# EAGLE design classic2mega (EAGLE 8.7.1)
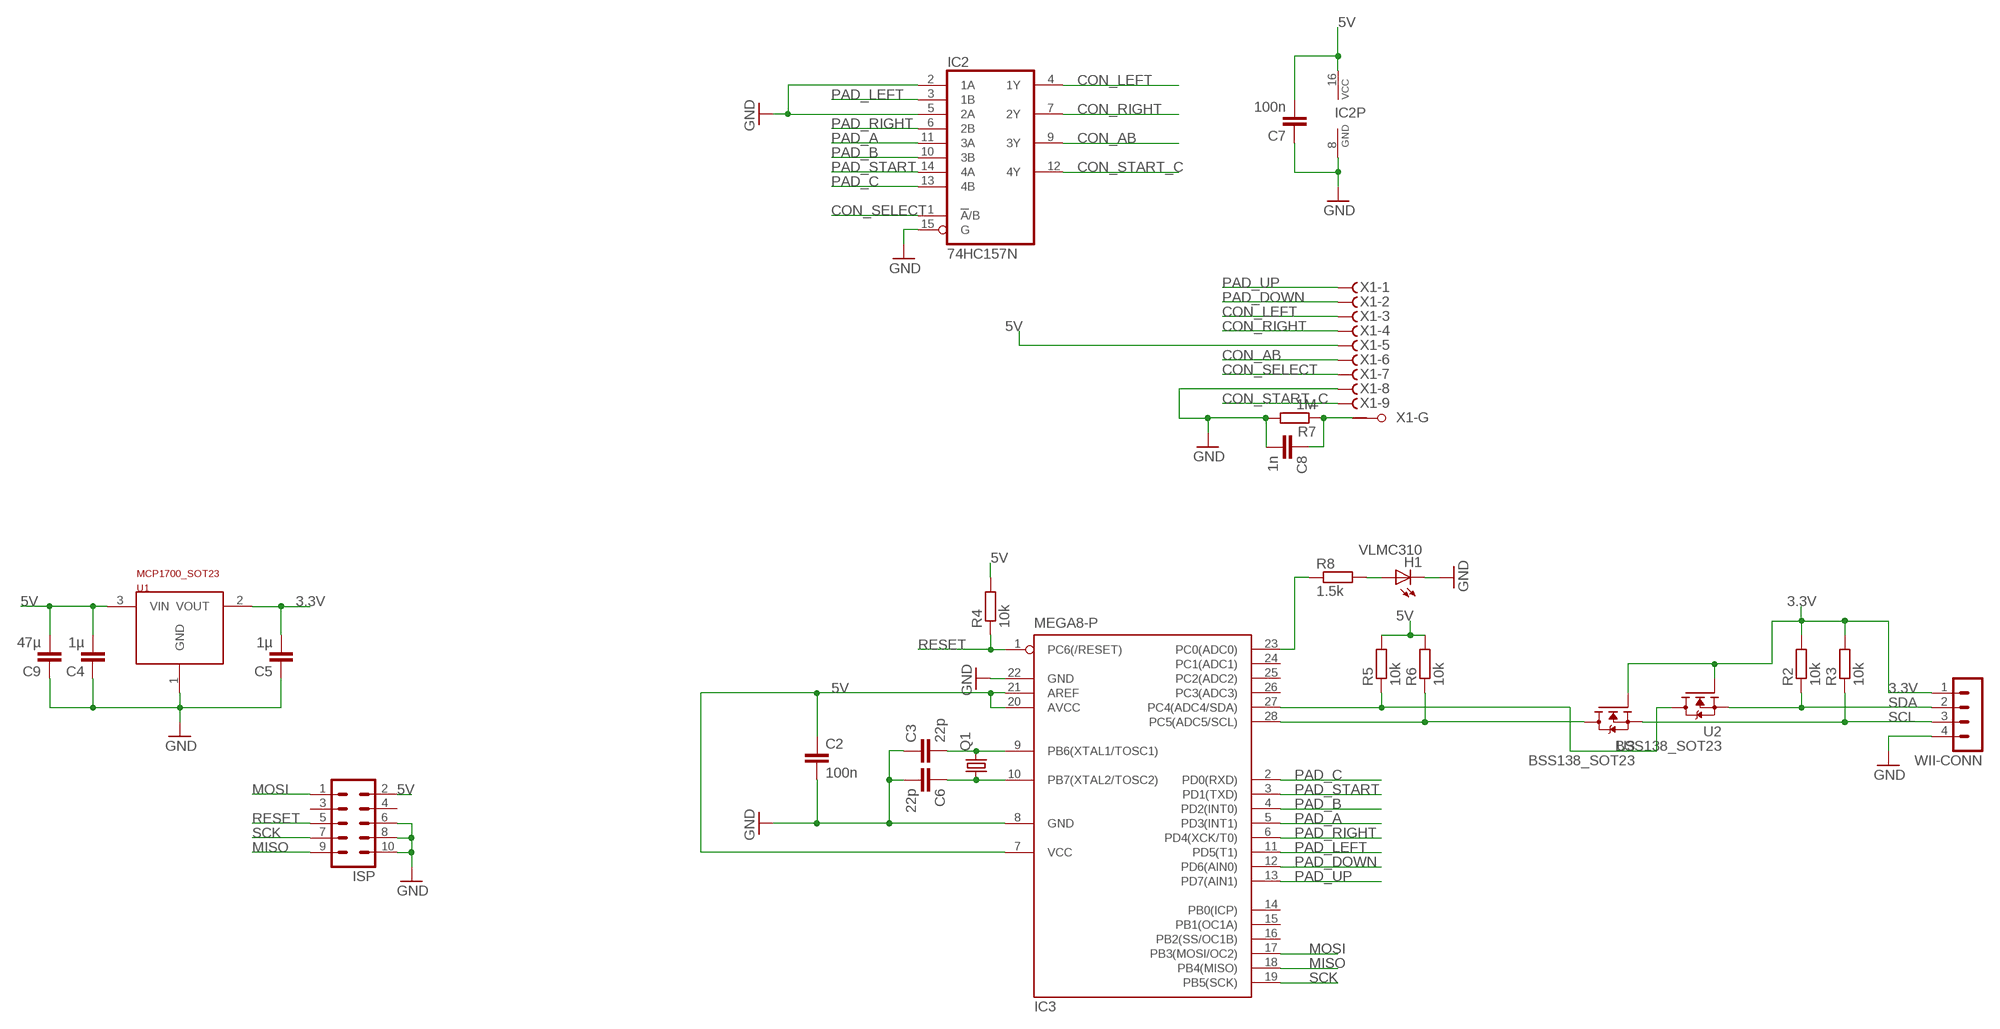
[diagram p0: schematic, sheet 1]

## Parts
C2  100n  C-EUC0805K  [C0805K]
C3  22p  C-EUC0805K  [C0805K]
C4  1µ  C-EUC0805K  [C0805K]
C5  1µ  C-EUC0805K  [C0805K]
C6  22p  C-EUC0805K  [C0805K]
C7  100n  C-EUC0805K  [C0805K]
C8  1n  C-EUC0805K  [C0805K]
C9  47µ  C-EUC1210  [C1210]
H1  VLMC310  [PLCC-2]
IC2  74HC157N  [DIL16]
IC3  MEGA8-P  [DIL28-3]
ISP  MA05-2  [MA05-2]
Q1  CRYSTALHC49S  [HC49/S]
R2  10k  R-EU_M0805  [M0805]
R3  10k  R-EU_M0805  [M0805]
R4  10k  R-EU_M0805  [M0805]
R5  10k  R-EU_M0805  [M0805]
R6  10k  R-EU_M0805  [M0805]
R7  1M  R-EU_M0805  [M0805]
R8  1.5k  R-EU_M0805  [M0805]
U1  MCP1700_SOT23  [SOT23]
U2  BSS138_SOT23  [SOT23]
U3  BSS138_SOT23  [SOT23]
WII-CONN  MA04-1  [MA04-1]
X1  F09HPS  [F09HP]

## Nets
3.3V: C5.2 R2.2 R3.2 U1.2(VOUT) U2.1(G) U3.1(G) WII-CONN.1
5V: C2.1 C4.2 C7.2 C9.2 IC2.16(VCC) IC3.7(VCC) IC3.20(AVCC) IC3.21(AREF) ISP.2 R4.2 R5.2 R6.2 U1.3(VIN) X1.5(-5:F)
CON_AB: IC2.9(3Y) X1.6(-6:F)
CON_LEFT: IC2.4(1Y) X1.3(-3:F)
CON_RIGHT: IC2.7(2Y) X1.4(-4:F)
CON_SELECT: IC2.1(!A!/B) X1.7(-7:F)
CON_START_C: IC2.12(4Y) X1.9(-9:F)
GND: C2.2 C3.1 C4.1 C5.1 C6.2 C7.1 C8.2 C9.1 H1.C IC2.2(1A) IC2.5(2A) IC2.8(GND) IC2.15(G) IC3.8(GND) IC3.22(GND) ISP.6 ISP.8 ISP.10 R7.2 U1.1(GND) WII-CONN.4 X1.8(-8:F)
MISO: IC3.18(PB4(MISO)) ISP.9
MOSI: IC3.17(PB3(MOSI/OC2)) ISP.1
N$1: IC3.27(PC4(ADC4/SDA)) R5.1 U2.3(D)
N$2: IC3.23(PC0(ADC0)) R8.1
N$3: C3.2 IC3.9(PB6(XTAL1/TOSC1)) Q1.2
N$4: IC3.28(PC5(ADC5/SCL)) R6.1 U3.3(D)
N$5: C6.1 IC3.10(PB7(XTAL2/TOSC2)) Q1.1
N$7: C8.1 R7.1 X1.G1(-G:G1)
N$9: H1.A R8.2
PAD_A: IC2.11(3A) IC3.5(PD3(INT1))
PAD_B: IC2.10(3B) IC3.4(PD2(INT0))
PAD_C: IC2.13(4B) IC3.2(PD0(RXD))
PAD_DOWN: IC3.12(PD6(AIN0)) X1.2(-2:F)
PAD_LEFT: IC2.3(1B) IC3.11(PD5(T1))
PAD_RIGHT: IC2.6(2B) IC3.6(PD4(XCK/T0))
PAD_START: IC2.14(4A) IC3.3(PD1(TXD))
PAD_UP: IC3.13(PD7(AIN1)) X1.1(-1:F)
RESET: IC3.1(PC6(/RESET)) ISP.5 R4.1
SCK: IC3.19(PB5(SCK)) ISP.7
SCL: R3.1 U3.2(S) WII-CONN.3
SDA: R2.1 U2.2(S) WII-CONN.2
Unconnected: IC3.14(PB0(ICP)) IC3.15(PB1(OC1A)) IC3.16(PB2(SS/OC1B)) IC3.24(PC1(ADC1)) IC3.25(PC2(ADC2)) IC3.26(PC3(ADC3)) ISP.3 ISP.4 X1.G2(-G:G2)

## Library data of the parts
C2-C9 = resistor:C-EU: CAPACITOR, European symbol
H1 = VLMC310:VLMC310
IC2 = 74xx-eu:74*157: Quadruple 2-line to 1-line data SELECTOR/MULTIPLEXER
IC3 = atmel:MEGA8-P: MICROCONTROLLER 8 Kbytes FLASH, 1 kbytes SRAM, 512 bytes EEPROM, USART, 4-channel 10 bit ADC, 2-channel 8 bit ADC Pin compatible with Atmega48, ATMega88, ATMega168 Source: avr.lbr; OC_FARNELL: unknown; OC_NEWARK: unknown
ISP = con-lstb:MA05-2: PIN HEADER; OC_FARNELL: unknown; OC_NEWARK: unknown
Q1 = crystal:CRYSTAL: CRYSTAL; OC_FARNELL: 1667008; OC_NEWARK: unknown
R2-R8 = resistor:R-EU_: RESISTOR, European symbol
U1 = MCP1700_SOT23:MCP1700_SOT23
U2 U3 = BSS138:BSS138_SOT23
WII-CONN = con-lstb:MA04-1: PIN HEADER; OC_FARNELL: unknown; OC_NEWARK: unknown
X1 = con-subd:F09HPS: SUB-D; OC_FARNELL: unknown; OC_NEWARK: unknown

## Board
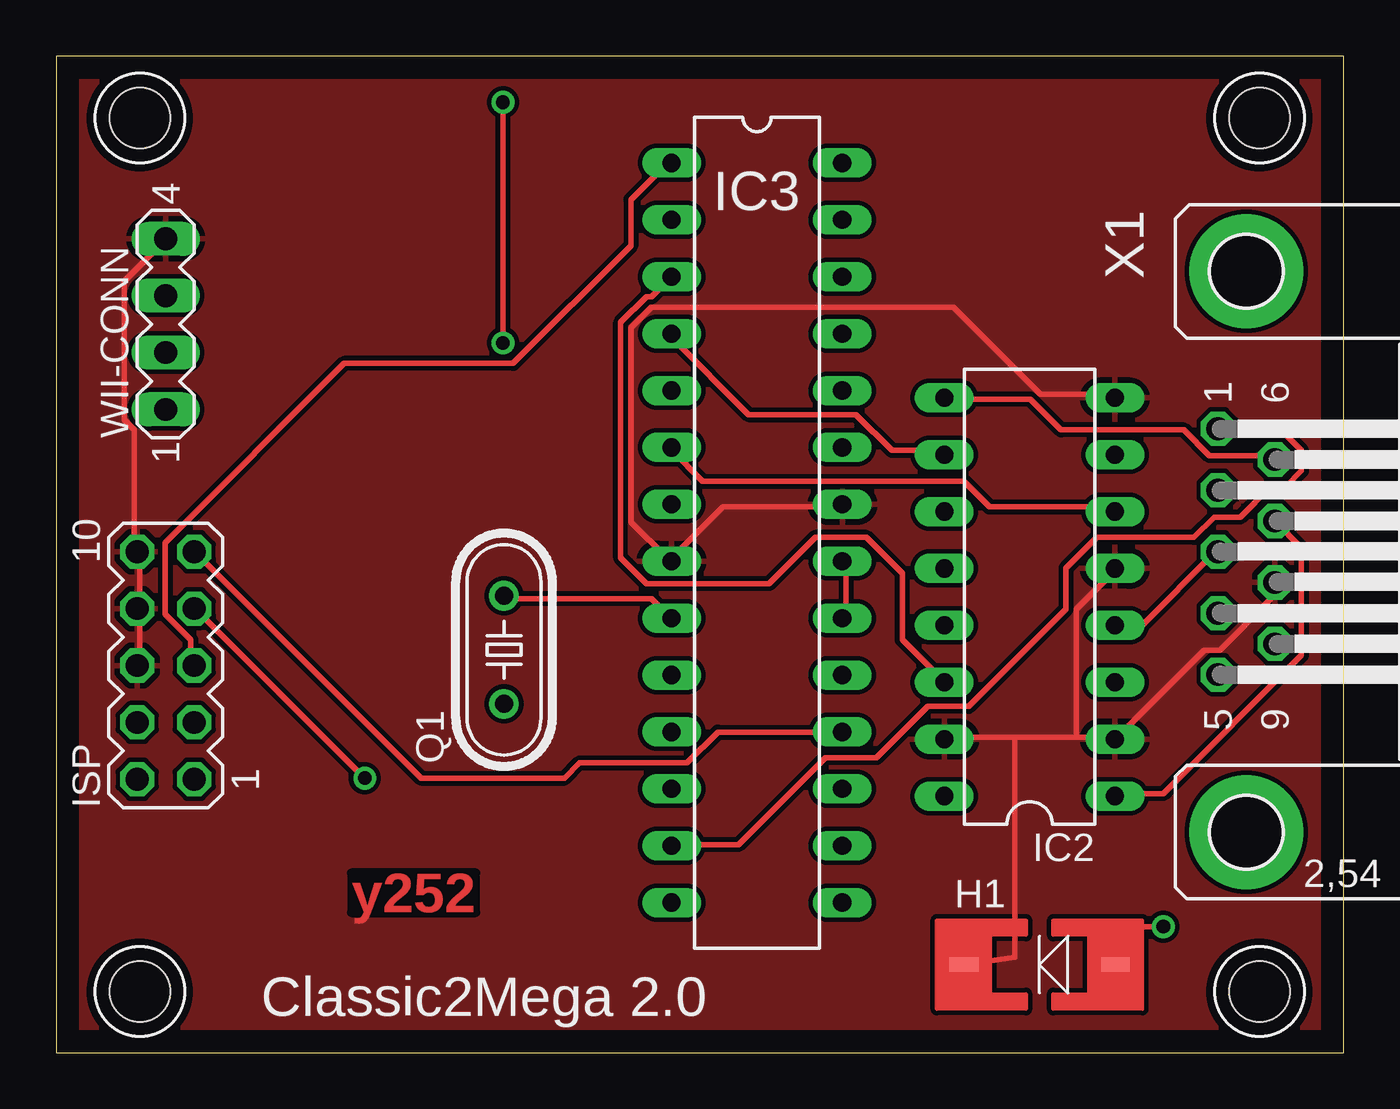
[diagram p1: board, top side]
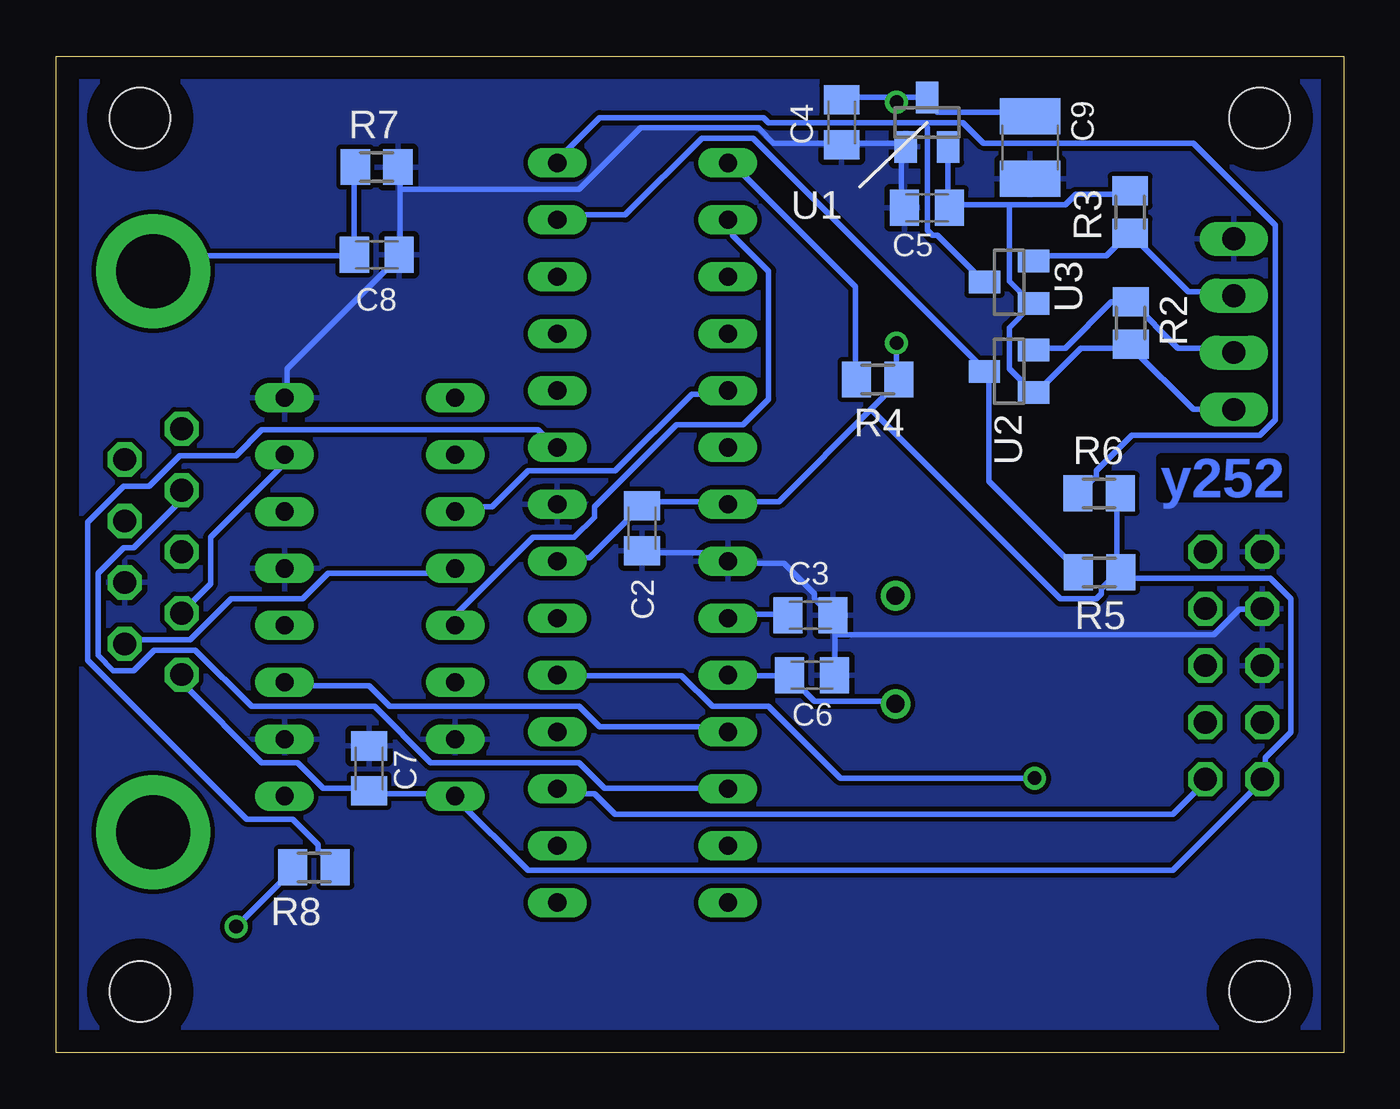
[diagram p2: board, bottom side, seen from below]

Size 57.5 x 44.5 mm. Coordinates in mm from the lower left corner, seen from the top.
Outline: 0,0 57.5,0 57.5,44.5 0,44.5 0,0
Copper layers (1*16): Top 0.035mm / dielectric 1.5mm / Bottom 0.035mm
Design rules "default": minimum track width 10mil, minimum drill 24mil, track to track 8mil, track to pad 8mil, pad to pad 8mil, via to via 8mil, smd to smd 8mil, copper to edge 40mil, drill to drill 8mil, minimum pad ring 10mil, minimum via ring 8mil, stop-mask expansion 4mil, vias tented up to drill 0mil, thermal gap 10mil

### Footprints (pad centres in the part's own frame; a part is rotated, then mirrored left to right if it is on the bottom)
C0805K = smd 1.3 x 1.6: 1 -1,0; 2 1,0
C1210 = smd 1.6 x 2.7: 1 -1.4,0; 2 1.4,0
PLCC-2 = smd 1.27 x 0.635: A 3.384,0; C -3.384,0
DIL16 = drill 0.813 long: 1 -8.89,-3.81; 2 -6.35,-3.81; 3 -3.81,-3.81; 4 -1.27,-3.81; 5 1.27,-3.81; 6 3.81,-3.81; 7 6.35,-3.81; 8 8.89,-3.81; 9 8.89,3.81; 10 6.35,3.81; 11 3.81,3.81; 12 1.27,3.81; 13 -1.27,3.81; 14 -3.81,3.81; 15 -6.35,3.81; 16 -8.89,3.81
DIL28-3 = drill 0.813 long: 1 -16.51,-3.81; 2 -13.97,-3.81; 3 -11.43,-3.81; 4 -8.89,-3.81; 5 -6.35,-3.81; 6 -3.81,-3.81; 7 -1.27,-3.81; 8 1.27,-3.81; 9 3.81,-3.81; 10 6.35,-3.81; 11 8.89,-3.81; 12 11.43,-3.81; 13 13.97,-3.81; 14 16.51,-3.81; 15 16.51,3.81; 16 13.97,3.81; 17 11.43,3.81; 18 8.89,3.81; 19 6.35,3.81; 20 3.81,3.81; 21 1.27,3.81; 22 -1.27,3.81; 23 -3.81,3.81; 24 -6.35,3.81; 25 -8.89,3.81; 26 -11.43,3.81; 27 -13.97,3.81; 28 -16.51,3.81
MA05-2 = drill 1.016 octagon: 1 -5.08,-1.27; 2 -5.08,1.27; 3 -2.54,-1.27; 4 -2.54,1.27; 5 0,-1.27; 6 0,1.27; 7 2.54,-1.27; 8 2.54,1.27; 9 5.08,-1.27; 10 5.08,1.27
HC49/S = drill 0.813: 1 -2.413,0; 2 2.413,0
M0805 = smd 1.3 x 1.6: 1 -0.95,0; 2 0.95,0
SOT23 = smd 1 x 1.4: 1 -0.95,-1.1; 2 0.95,-1.1; 3 0,1.1
G028-HOLES = hole 2.7: 9,-3.5; 59,-3.5; 9,-42.5; 59,-42.5
MA04-1 = drill 1.016 long: 1 -3.81,0; 2 -1.27,0; 3 1.27,0; 4 3.81,0
F09HP = drill 1.016 octagon: 1 -5.486,-1.27; 2 -2.743,-1.27; 3 0,-1.27; 4 2.743,-1.27; 5 5.486,-1.27; 6 -4.115,1.27; 7 -1.372,1.27; 8 1.372,1.27; 9 4.115,1.27 | drill 3.302 pad 5.08: G1 -12.522,0; G2 12.522,0

### Placement (x,y rotation side)
C2  31.32,23.42 270 bottom
C3  23.81,19.53 180 bottom
C4  22.41,41.54 90 bottom
C5  18.6,37.73 0 bottom
C6  23.74,16.86 0 bottom
C7  43.51,12.7 270 bottom
C8  43.17,35.63 0 bottom
C9  14,40.42 90 bottom
H1  43.93,3.94 0 top
IC2  43.48,20.35 90 top
IC3  31.3,23.22 270 top
ISP  4.9,17.29 90 top
Q1  20.01,17.99 90 top
R2  9.5,32.58 270 bottom
R3  9.53,37.53 90 bottom
R4  20.8,30.06 0 bottom
R5  10.9,21.45 0 bottom
R6  10.92,24.97 0 bottom
R7  43.18,39.54 0 bottom
R8  45.98,8.28 180 bottom
U1  18.6,41.54 0 bottom
U2  14.94,30.42 90 bottom
U3  14.93,34.4 90 bottom
U$6  [G028-HOLES]  -5.25,45.23 0 top
WII-CONN  4.9,32.53 90 top
X1  53.16,22.37 270 top

### Tracks (layer width: path | path; a pad name or v marks a point on that pad's centre or on a via)
3.3V
  Bottom 0.254: U1.2 17.68,40.38 17.68,37.86 C5.2 17.45,37.86 14.93,37.86 | 9.68,38.55 R3.2 9.68,38.32 11.96,38.32 12.42,37.86 14.93,37.86 | WII-CONN.1 6.7,28.72 9.45,31.46 R2.2 9.68,31.46 11.73,31.46 13.79,29.41 U2.1 14.02,29.63 14.93,30.55 14.93,32.38 14.02,33.29 U3.1 14.02,33.52 14.93,34.44 14.93,37.86
5V  (via drill 0.61)
  Top 0.254: IC3.20 35.28,19.58 35.28,21.86 IC3.21 | v19.96,31.69 v19.96,42.44
  Bottom 0.254: 19.96,42.66 22.25,42.66 C4.2 | 19.96,42.66 18.82,42.66 U1.3 | 18.59,42.66 U1.3 | R5.2 10.13,21.63 10.13,24.83 R6.2 | 21.1,28.72 25.22,24.6 27.28,24.6 IC3.7 27.51,24.6 31.16,24.6 C2.1 31.39,24.38 33.68,22.09 35.05,22.09 IC3.21 | 21.1,28.72 19.96,29.86 R4.2 19.96,30.09 v19.96,31.69 | 21.1,28.72 12.65,20.26 11.05,20.26 10.82,20.49 10.82,20.72 10.13,21.41 R5.2 | v19.96,42.44 19.96,42.66 | R5.2 9.9,21.41 9.68,21.18 3.27,21.18 2.36,20.26 2.36,14.32 3.5,13.18 3.5,12.26 ISP.2 3.73,12.03 7.62,8.15 36.42,8.15 39.62,11.35 IC2.16 39.85,11.57 43.51,11.57 C7.2 43.74,11.8 45.56,11.8 46.71,12.95 48.31,12.95 51.74,16.38 51.74,16.83 X1.5 | C9.2 14.02,41.98 18.13,41.98 18.59,42.44 U1.3
CON_AB
  Top 0.254: IC2.9 39.85,29.18 43.51,29.18 44.88,27.81 50.37,27.81 51.51,26.66 54.25,26.66 X1.6
CON_LEFT
  Top 0.254: IC2.4 47.39,19.12 48.54,19.12 51.74,22.32 X1.3
CON_RIGHT
  Bottom 0.254: IC2.7 47.39,26.66 47.39,26.2 50.59,23.01 50.59,20.95 51.74,19.8 X1.4
CON_SELECT
  Top 0.254: X1.7 55.62,22.55 55.62,17.75 49.45,11.57 47.39,11.57 IC2.1
CON_START_C
  Bottom 0.254: IC2.12 39.85,21.41 45.34,21.41 46.48,20.26 49.68,20.26 51.51,18.43 54.25,18.43 X1.9
GND
  Top 0.254: ISP.6 3.73,17.29 3.73,19.8 ISP.8 3.73,20.03 3.73,22.32 ISP.10 3.5,22.55 3.5,27.81 3.05,28.26 3.05,34.44 4.88,36.26 WII-CONN.4 | IC3.22 35.05,24.38 29.79,24.38 27.51,22.09 IC3.8 27.28,22.09 25.68,23.69 25.68,32.38 26.59,33.29 40.08,33.29 43.97,29.41 47.17,29.41 IC2.8 | 45.56,14.09 47.17,14.09 IC2.2 47.39,14.09 51.28,17.98 51.97,17.98 54.25,20.26 54.25,20.95 X1.8 | 45.56,14.09 42.82,14.09 | 42.82,14.09 39.85,14.09 IC2.15 | 42.82,14.09 42.82,4.26 H1.C | 45.56,14.09 45.56,19.8 47.17,21.41 IC2.5
  Bottom 0.254: C5.1 19.73,37.86 19.73,40.38 U1.1 19.73,40.61 22.25,40.61 C4.1 22.48,40.61 25.45,40.61 26.13,41.29 31.39,41.29 34.13,38.55 42.14,38.55 | 42.14,38.55 42.14,39.46 R7.2 | 42.14,38.55 42.14,35.81 C8.2 42.14,35.58 47.17,30.55 47.17,29.41 IC2.8 | 5.1,36.49 WII-CONN.4 | 22.7,18.66 22.7,19.35 C3.1 22.93,19.58 23.62,20.26 23.62,20.49 24.99,21.86 27.28,21.86 IC3.8 27.51,22.09 27.73,22.32 31.16,22.32 C2.2 | 22.7,18.66 22.7,17.06 C6.2 | 22.7,18.66 5.79,18.66 4.65,19.8 3.73,19.8 ISP.8
  pour Top: 0.34,44.23 0.34,0.41 57.24,0.41 57.24,44.23 0.35,44.23
  pour Bottom: 0.42,44.11 57.1,44.11 57.1,0.37 0.45,0.37 0.45,44.08
MISO
  Top 0.254: 35.28,14.55 IC3.18 35.05,14.32 29.56,14.32 28.19,12.95 23.39,12.95 22.7,12.26 16.3,12.26 6.25,22.32 ISP.9
MOSI
  Bottom 0.254: IC3.17 35.05,11.57 33.45,11.57 32.53,10.66 7.62,10.66 6.25,12.03 ISP.1
N$1
  Bottom 0.254: R5.1 11.96,21.63 15.85,25.52 15.85,30.32 U2.3 16.08,30.55 26.36,40.84 28.65,40.84 32.08,37.41 35.05,37.41 IC3.27
N$2
  Bottom 0.254: R8.1 45.11,8.38 45.79,9.06 45.79,9.29 46.94,10.43 48.99,10.43 56.08,17.52 56.08,23.69 54.48,25.29 53.34,25.29 51.97,26.66 49.45,26.66 48.31,27.81 35.96,27.81 35.28,27.12 IC3.23
N$3
  Top 0.254: Q1.2 20.19,20.26 26.59,20.26 27.28,19.58 IC3.9
  Bottom 0.254: C3.2 24.99,19.58 27.28,19.58 IC3.9
N$4
  Bottom 0.254: 18.82,41.52 18.59,41.29 18.59,36.72 18.36,36.49 18.13,36.49 16.08,34.44 U3.3 | 18.82,41.52 25.68,41.52 25.91,41.75 33.22,41.75 35.05,39.92 IC3.28 | R6.1 11.73,25.06 11.05,25.75 11.05,25.98 9.45,27.58 3.73,27.58 3.05,28.26 3.05,36.95 6.7,40.61 16.08,40.61 16.99,41.52 18.82,41.52
N$5
  Bottom 0.254: 24.76,16.83 27.28,16.83 IC3.10 | 24.76,16.83 23.62,15.69 20.19,15.69 Q1.1 | 24.76,16.83 C6.1
N$7
  Bottom 0.254: R7.1 44.19,39.46 44.19,35.81 C8.1 44.19,35.58 52.42,35.58 53.11,34.89 X1.G1
N$9  (via drill 0.61)
  Top 0.254: v49.45,5.63 47.3,5.62 H1.A
  Bottom 0.254: v49.45,5.63 46.94,8.15 R8.2
PAD_A
  Bottom 0.254: IC2.11 39.62,24.38 38.02,24.38 36.42,25.98 32.53,25.98 29.11,29.41 27.51,29.41 IC3.5
PAD_B
  Top 0.254: IC2.10 39.62,26.89 37.34,26.89 35.74,28.49 30.94,28.49 27.51,31.92 IC3.4
PAD_C
  Bottom 0.254: IC3.2 27.28,37.18 27.28,36.49 25.68,34.89 25.68,29.18 26.82,28.03 29.79,28.03 33.45,24.38 33.45,23.92 34.36,23.01 36.19,23.01 39.62,19.58 39.62,19.12 IC2.13
PAD_DOWN
  Bottom 0.254: IC3.12 27.51,11.8 32.99,11.8 34.13,12.95 40.77,12.95 43.28,15.46 48.77,15.46 51.28,17.98 53.11,17.98 54.02,17.06 54.94,17.06 55.62,17.75 55.62,21.41 54.48,22.55 54.02,22.55 51.97,24.6 51.97,25.06 X1.2
PAD_LEFT
  Bottom 0.254: IC3.11 27.51,14.55 33.22,14.55 34.13,15.46 42.59,15.46 43.51,16.38 47.17,16.38 IC2.3
PAD_RIGHT
  Top 0.254: IC2.6 47.17,24.38 41.68,24.38 40.54,25.52 28.88,25.52 27.51,26.89 IC3.6
PAD_START
  Top 0.254: IC3.3 27.28,34.44 26.59,33.75 26.36,33.75 25.22,32.61 25.22,22.09 26.36,20.95 31.85,20.95 33.91,23.01 36.19,23.01 37.79,21.41 37.79,18.43 39.62,16.6 IC2.14
PAD_UP
  Top 0.254: IC3.13 27.51,9.29 30.48,9.29 34.36,13.18 36.65,13.18 38.94,15.46 40.77,15.46 45.11,19.8 45.11,21.63 46.48,23.01 50.82,23.01 51.74,23.92 52.88,23.92 54.25,25.29 54.94,25.29 55.62,25.98 55.62,26.89 54.71,27.81 51.97,27.81 X1.1
RESET
  Top 0.254: ISP.5 6.02,17.29 6.02,18.43 4.88,19.58 4.88,22.78 12.88,30.78 20.42,30.78 25.68,36.03 25.68,38.09 27.28,39.69 IC3.1
  Bottom 0.254: R4.1 21.79,30.09 21.79,34.21 27.28,39.69 IC3.1
SCK  (via drill 0.61)
  Top 0.254: 35.05,16.83 IC3.19 | v13.79,12.26 6.25,19.8 ISP.7
  Bottom 0.254: v13.79,12.26 22.48,12.26 25.68,15.46 28.19,15.46 29.56,16.83 35.05,16.83 IC3.19
SCL
  Bottom 0.254: U3.2 13.79,35.58 10.59,35.58 9.68,36.49 R3.1 9.45,36.49 6.93,33.98 5.1,33.98 WII-CONN.3
SDA
  Bottom 0.254: U2.2 13.79,31.46 12.42,31.46 10.36,33.52 9.68,33.52 R2.1 9.45,33.52 7.39,31.46 5.1,31.46 WII-CONN.2

### Text on the board
Top: y252
Bottom: y252
tPlace: Classic2Mega 2.0